# Altium project Flyback1.PrjPCB
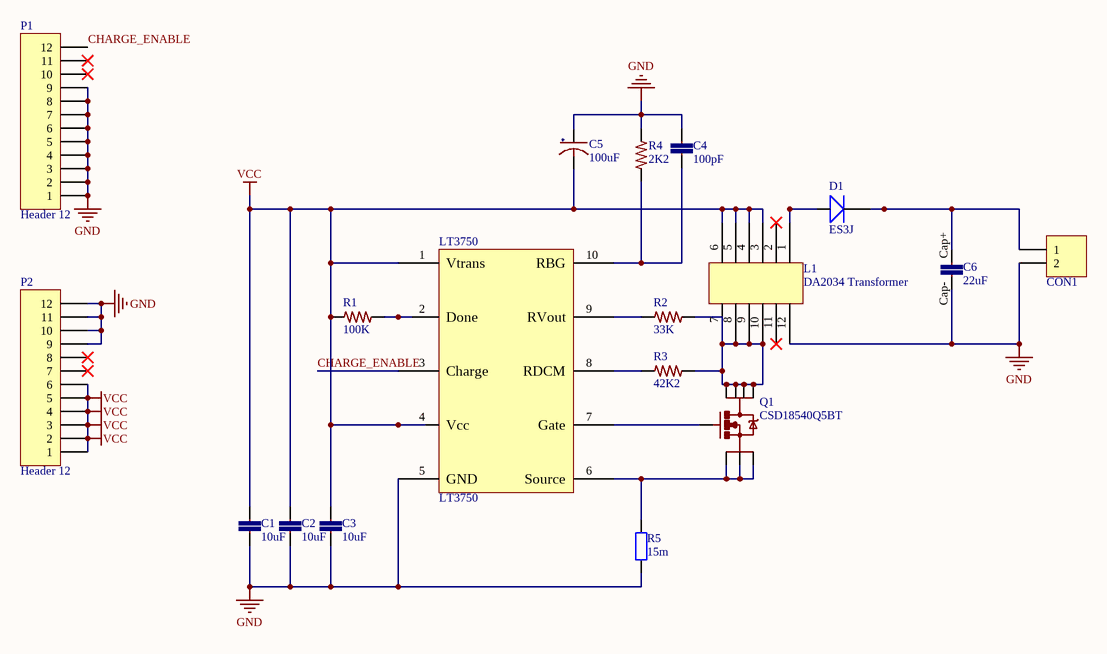
[diagram p0: Sch Flyback.SchDoc]
1 sheet, 18 parts. Net scope: global (net labels, ports and power ports of the same name join across sheets).
Board file: PCB Flyback.PcbDoc

## Sheet Sch Flyback.SchDoc
size A4

### Parts
C1  10uF  [CAPC0603(1608)55_L]
C2  10uF  [CAPC0603(1608)55_L]
C3  10uF  [CAPC0603(1608)55_L]
C4  100pF  [CAPC0603(1608)55_L]
C5  100uF  [PCBComponent]
C6  22uF  [CAP ALUM 22UF 250V]
CON1  OSTTA024163  [Term Block 2P]  (value not drawn)
D1  ES3J  [Diode]
L1  DA2034 Transformer  [DA2034 Transformer]
LT3750  LT3750  [LT3750]
P1  Header 12  [HDR1X12]
P2  Header 12  [HDR1X12]
Q1  CSD18540Q5BT  [PCBComponent]
R1  100K  [0402-RES-HD]
R2  33K  [0402-RES-HD]
R3  42K2  [0402-RES-HD]
R4  2K2  [0402-RES-HD]
R5  15m  [RES1206]

### Nets
GND: C1.2 C2.2 C3.2 C4.1 C5.1(+) C6.Cap- CON1.2 L1.12 LT3750.5(GND) P1.1 P1.2 P1.3 P1.4 P1.5 P1.6 P1.7 P1.8 P1.9 P2.9 P2.10 P2.11 P2.12 R4.2 R5.2
VCC: C1.1 C2.1 C3.1 C5.2(-) L1.3 L1.4 L1.5 L1.6 LT3750.1(Vtrans) LT3750.4(Vcc) P2.1 P2.2 P2.3 P2.4 P2.5 P2.6 R1.1
CHARGE_ENABLE: LT3750.3(Charge) P1.12
NetC4_2: C4.2 LT3750.10(RBG) R4.1
NetC6_Cap+: C6.Cap+ CON1.1 D1.D1+
NetD1_D1-: D1.D1- L1.1
NetL1_7: L1.7 L1.8 L1.9 L1.10 Q1.5(D) Q1.6(D) Q1.7(D) Q1.8(D) R2.2 R3.1
NetLT3750_2: LT3750.2(Done) R1.2
NetLT3750_6: LT3750.6(Source) Q1.1(S) Q1.2(S) Q1.3(S) R5.1
NetLT3750_7: LT3750.7(Gate) Q1.4(G)
NetLT3750_8: LT3750.8(RDCM) R3.2
NetLT3750_9: LT3750.9(RVout) R2.1

Not connected (* = marked no-connect by the designer): L1 2* 11*; P1 10* 11*; P2 7* 8*

### Library data of the parts
C1-C3 = C0603-10uF-16V-1: CAP CER 10UF 16V X5R 0603; Part No: EMK107BBJ106MA-T; Cod EMS: 05.281.019.592; Value: 10uF
C4 = CC0603--1: CAP CER 100PF 50V NP0 0603; Part No: GRM1885C1H101JA01D; Value: 100pF
C5 = CA-100uF-3: CAP ALUM 100UF 20% 80V SMD
C6 = CAP ALUM 22UF 250V
CON1 = Term Block 2P: 2 Position Wire to Board Terminal Block Horizontal with Board 0.200" (5.08mm) Through Hole
D1 = Diode
P1 P2 = Header 12: Header, 12-Pin; LatestRevisionDate: 17-Jul-2002; LatestRevisionNote: Re-released for DXP Platform.; Publisher: Altium Limited
Q1 = CSD18540Q5BT-1: MOSFET N-CH 60V 100A 8VSON; Part No: CSD18540Q5BT
R1 = R0402-100K-11: RES 100K OHM 1/10W 1% 0402 SMD 1; Part No: ERJ-2GEJ104X; Cod EMS: 05.280.029.504; Family Description: RESISTOR FILME ESPESSO 0R-1M / 1/10W / 5% /  0402. P/N: ERJ-2GE....X – PANASONIC ELECTRONIC COMPONENTS.; Family: ERJ-2GE....X; Value: 100k
R2 = R0402-33K-7: RES 33K OHM 1/10W 1% 0402 SMD; Part No: ERJ-2RKF3302X; Cod EMS: 05.280.029.535; Family Description: RESISTOR FILME ESPESSO 10R-1M / 1/10W / 1% / 0402. P/N: ERJ-2RKF....X – PANASONIC ELECTRONIC COMPONENTS.; Value: 33K; Family: ERJ-2RKF....X
R3 = R0402-42K2-1: RES 42.2K OHM 1/10W 1% 0402 SMD; Part No: ERJ-2RKF4222X; Value: 42.2K
R4 = R0402-2K2-5: RES 2.2K OHM 1/10W 1% 0402 SMD; Part No: ERJ-2RKF2201X; Cod EMS: 05.280.029.541; Family Description: RESISTOR FILME ESPESSO 10R-1M / 1/10W / 1% / 0402. P/N: ERJ-2RKF....X – PANASONIC ELECTRONIC COMPONENTS.; Value: 2.2K; Family: ERJ-2RKF....X
R5 = Res2: Current Sense Resistors - SMD 1206 1Watt 0.015Ohms 1%; Published: 8-Jun-2000; LatestRevisionDate: 17-Jul-2002; LatestRevisionNote: Re-released for DXP Platform.; PackageReference: AXIAL-0.4; Publisher: Altium Limited; PackageDescription: Axial Device, Thru-Hole; 2 Leads; 0.4 in Pin Spacing; Value: 15m